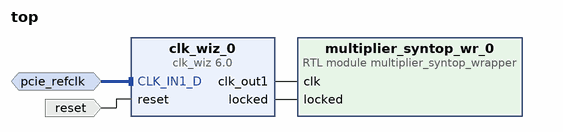
[diagram p0: block diagram of the top level]
# Vivado block design top, xcu55c-fsvh2892-2L-e, Vivado 2021.2
create_bd_design top

create_bd_intf_port -mode Slave -vlnv xilinx.com:interface:diff_clock_rtl:1.0 pcie_refclk
set_property -dict {CONFIG.FREQ_HZ 100000000} [get_bd_intf_ports pcie_refclk]
create_bd_port -dir I -type rst reset
set_property -dict {CONFIG.POLARITY ACTIVE_HIGH} [get_bd_ports reset]

create_bd_cell -type ip -vlnv xilinx.com:ip:clk_wiz:6.0 clk_wiz_0
set_property -dict [list \
  CONFIG.CLKIN2_JITTER_PS 148.43 \
  CONFIG.CLKOUT1_JITTER 98.427 \
  CONFIG.CLKOUT1_PHASE_ERROR 87.466 \
  CONFIG.CLKOUT1_REQUESTED_OUT_FREQ 250.000 \
  CONFIG.CLK_IN1_BOARD_INTERFACE pcie_refclk \
  CONFIG.MMCM_CLKFBOUT_MULT_F 11.875 \
  CONFIG.MMCM_CLKIN2_PERIOD 10.000 \
  CONFIG.MMCM_CLKOUT0_DIVIDE_F 4.750 \
  CONFIG.OPTIMIZE_CLOCKING_STRUCTURE_EN true \
  CONFIG.PRIM_SOURCE Differential_clock_capable_pin \
  CONFIG.RESET_BOARD_INTERFACE Custom \
  CONFIG.SECONDARY_SOURCE Single_ended_clock_capable_pin \
  CONFIG.USE_BOARD_FLOW true \
  CONFIG.USE_INCLK_SWITCHOVER false \
] [get_bd_cells clk_wiz_0]
create_bd_cell -type module -reference multiplier_syntop_wrapper multiplier_syntop_wr_0

# ---- connections ----

connect_bd_intf_net [get_bd_intf_ports pcie_refclk] [get_bd_intf_pins clk_wiz_0/CLK_IN1_D]
connect_bd_net [get_bd_pins clk_wiz_0/clk_out1] [get_bd_pins multiplier_syntop_wr_0/clk]
connect_bd_net [get_bd_pins clk_wiz_0/locked] [get_bd_pins multiplier_syntop_wr_0/locked]
connect_bd_net [get_bd_ports reset] [get_bd_pins clk_wiz_0/reset]

validate_bd_design
save_bd_design
